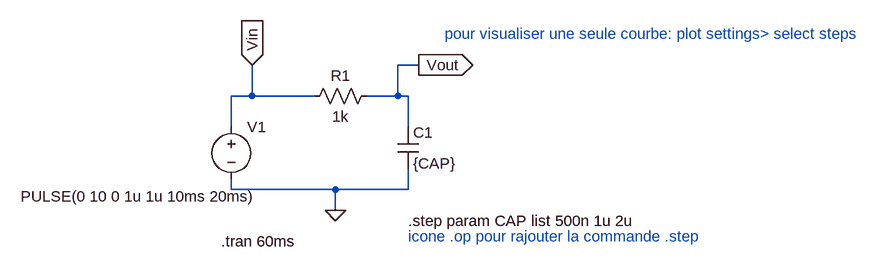
[diagram p0: schematic circuitRC.asc]
circuitRC.asc, the LTspice schematic file:
Version 4
SHEET 1 1320 680
WIRE 384 -16 352 -16
WIRE 128 32 128 -16
WIRE 128 32 96 32
WIRE 224 32 128 32
WIRE 352 32 352 -16
WIRE 352 32 304 32
WIRE 368 32 352 32
WIRE 96 80 96 32
WIRE 368 80 368 32
WIRE 96 176 96 160
WIRE 256 176 96 176
WIRE 368 176 368 144
WIRE 368 176 256 176
WIRE 256 208 256 176
FLAG 256 208 0
FLAG 128 -16 Vin
IOPIN 128 -16 In
FLAG 384 -16 Vout
IOPIN 384 -16 Out
SYMBOL voltage 96 64 R0
WINDOW 3 -324 123 Left 2
WINDOW 123 0 0 Left 2
WINDOW 39 0 0 Left 2
SYMATTR InstName V1
SYMATTR Value PULSE(0 10 0 1u 1u 10ms 20ms)
SYMBOL res 320 16 R90
WINDOW 0 0 56 VBottom 2
WINDOW 3 32 56 VTop 2
SYMATTR InstName R1
SYMATTR Value 1k
SYMBOL cap 352 80 R0
SYMATTR InstName C1
SYMATTR Value {CAP}
TEXT 80 256 Left 2 !.tran 60ms
TEXT 368 224 Left 2 !.step param CAP list 500n 1u 2u
TEXT 368 248 Left 2 ;icone .op pour rajouter la commande .step
TEXT 424 -64 Left 2 ;pour visualiser une seule courbe: plot settings> select steps

The netlist it stands for:
* circuitRC.asc
V1 Vin 0 PULSE(0 10 0 1u 1u 10ms 20ms)
R1 Vout Vin 1k
C1 Vout 0 {CAP}
.tran 60ms
.step param CAP list 500n 1u 2u
* icone .op pour rajouter la commande .step
* pour visualiser une seule courbe: plot settings> select steps
.backanno
.end

* Results of the author's LTspice run, read from the files saved beside the schematic
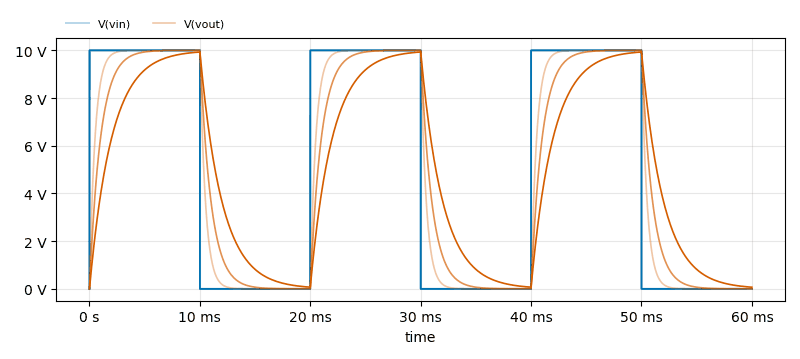
[diagram p1: Transient Analysis of circuitRC.asc, plotted from the saved traces]
* Transient Analysis, 5 runs:
*   V(vin) [run 1]: min 0 V, max 10 V, average 5 V, rms 7.071 V, last 0 V
*   V(vin) [run 2]: 0 V at time=0 s, 0 V at time=0 s, min 0 V, max 0 V
*   V(vin) [run 3]: min 0 V, max 10 V, average 5.001 V, rms 7.071 V, last 0 V
*   V(vin) [run 4]: 0 V at time=0 s, 0 V at time=0 s, min 0 V, max 0 V
*   V(vin) [run 5]: min 0 V, max 10 V, average 5.001 V, rms 7.071 V, last 0 V
*   V(vout) [run 1]: min 0 V, max 10 V, average 5.001 V, rms 6.893 V, last 0 V
*   V(vout) [run 2]: 0 V at time=0 s, 0 V at time=0 s, min 0 V, max 0 V
*   V(vout) [run 3]: min 0 V, max 10 V, average 5.001 V, rms 6.709 V, last 453.4 µV
*   V(vout) [run 4]: 0 V at time=0 s, 0 V at time=0 s, min 0 V, max 0 V
*   V(vout) [run 5]: min 0 V, max 9.933 V, average 4.999 V, rms 6.335 V, last 66.96 mV